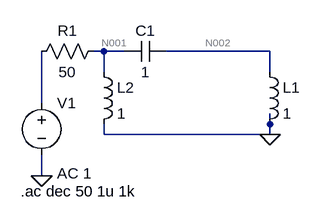
[diagram p0: schematic realim-rlc.asc]
realim-rlc.asc, the LTspice schematic file:
Version 4
SHEET 1 880 680
WIRE 32 96 16 96
WIRE 64 96 32 96
WIRE 288 96 128 96
WIRE 32 128 32 96
WIRE 288 128 288 96
WIRE -64 176 -64 96
WIRE 288 208 288 192
WIRE 32 224 32 208
WIRE 288 224 288 208
WIRE 288 224 32 224
WIRE -64 288 -64 256
FLAG 288 224 0
FLAG -64 288 0
SYMBOL voltage -64 160 R0
WINDOW 123 24 124 Left 2
WINDOW 39 0 0 Left 0
SYMATTR Value2 AC 1
SYMATTR InstName V1
SYMATTR Value ""
SYMBOL ind 272 112 R0
SYMATTR InstName L1
SYMATTR Value 1
SYMBOL cap 128 80 R90
WINDOW 0 0 32 VBottom 2
WINDOW 3 32 32 VTop 2
SYMATTR InstName C1
SYMATTR Value 1
SYMBOL ind 16 112 R0
SYMATTR InstName L2
SYMATTR Value 1
SYMBOL res 32 80 R90
WINDOW 0 0 56 VBottom 2
WINDOW 3 32 56 VTop 2
SYMATTR InstName R1
SYMATTR Value 50
TEXT -96 312 Left 2 !.ac dec 50 1u 1k

The netlist it stands for:
* realim-rlc.asc
V1 N003 0 AC 1
L1 N002 0 1
C1 N002 N001 1
L2 N001 0 1
R1 N001 N003 50
.ac dec 50 1u 1k
.backanno
.end

* Results of the author's LTspice run, read from the files saved beside the schematic
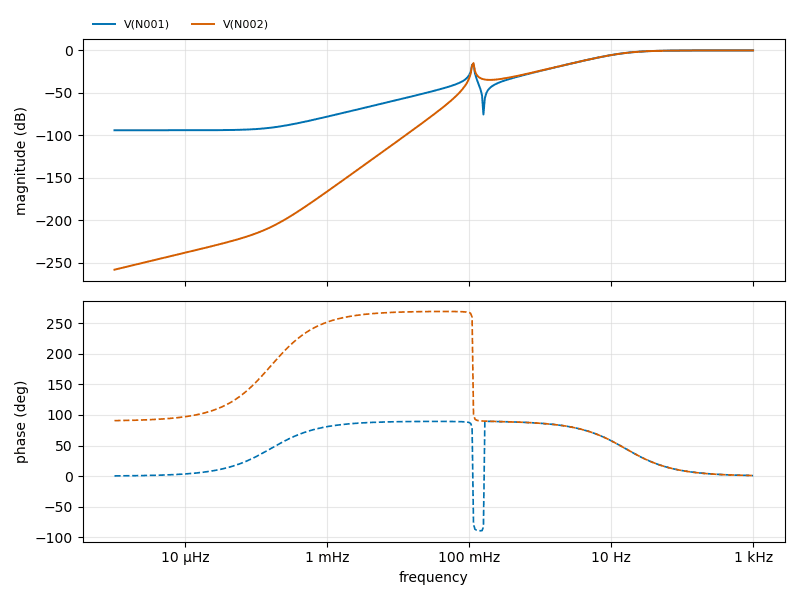
[diagram p1: AC Analysis of realim-rlc.asc, plotted from the saved traces]
* AC Analysis, 1 run:
*   V(N001): -93.98 dB at 1 µHz, -0.00 dB at 1 kHz, peak -0.00 dB at 1 kHz, 3 dB below the peak at 15.91 Hz
*   V(N002): -258.02 dB at 1 µHz, -0.00 dB at 1 kHz, peak -0.00 dB at 1 kHz, 3 dB below the peak at 15.91 Hz